# EasyEDA Pro project 智能车核心板.epro

# Schematic 底座核心板

## Sheets
1 底座核心板: Board Name: Board1; Create Date: 2025-10-22; Page Name: 底座核心板; Project Name: 智能车中控核心板; Schematic Name: 底座核心板; Update Date: 2026-01-29; Company: 嘉立创EDA; Page Size: A4; Version: V1.0
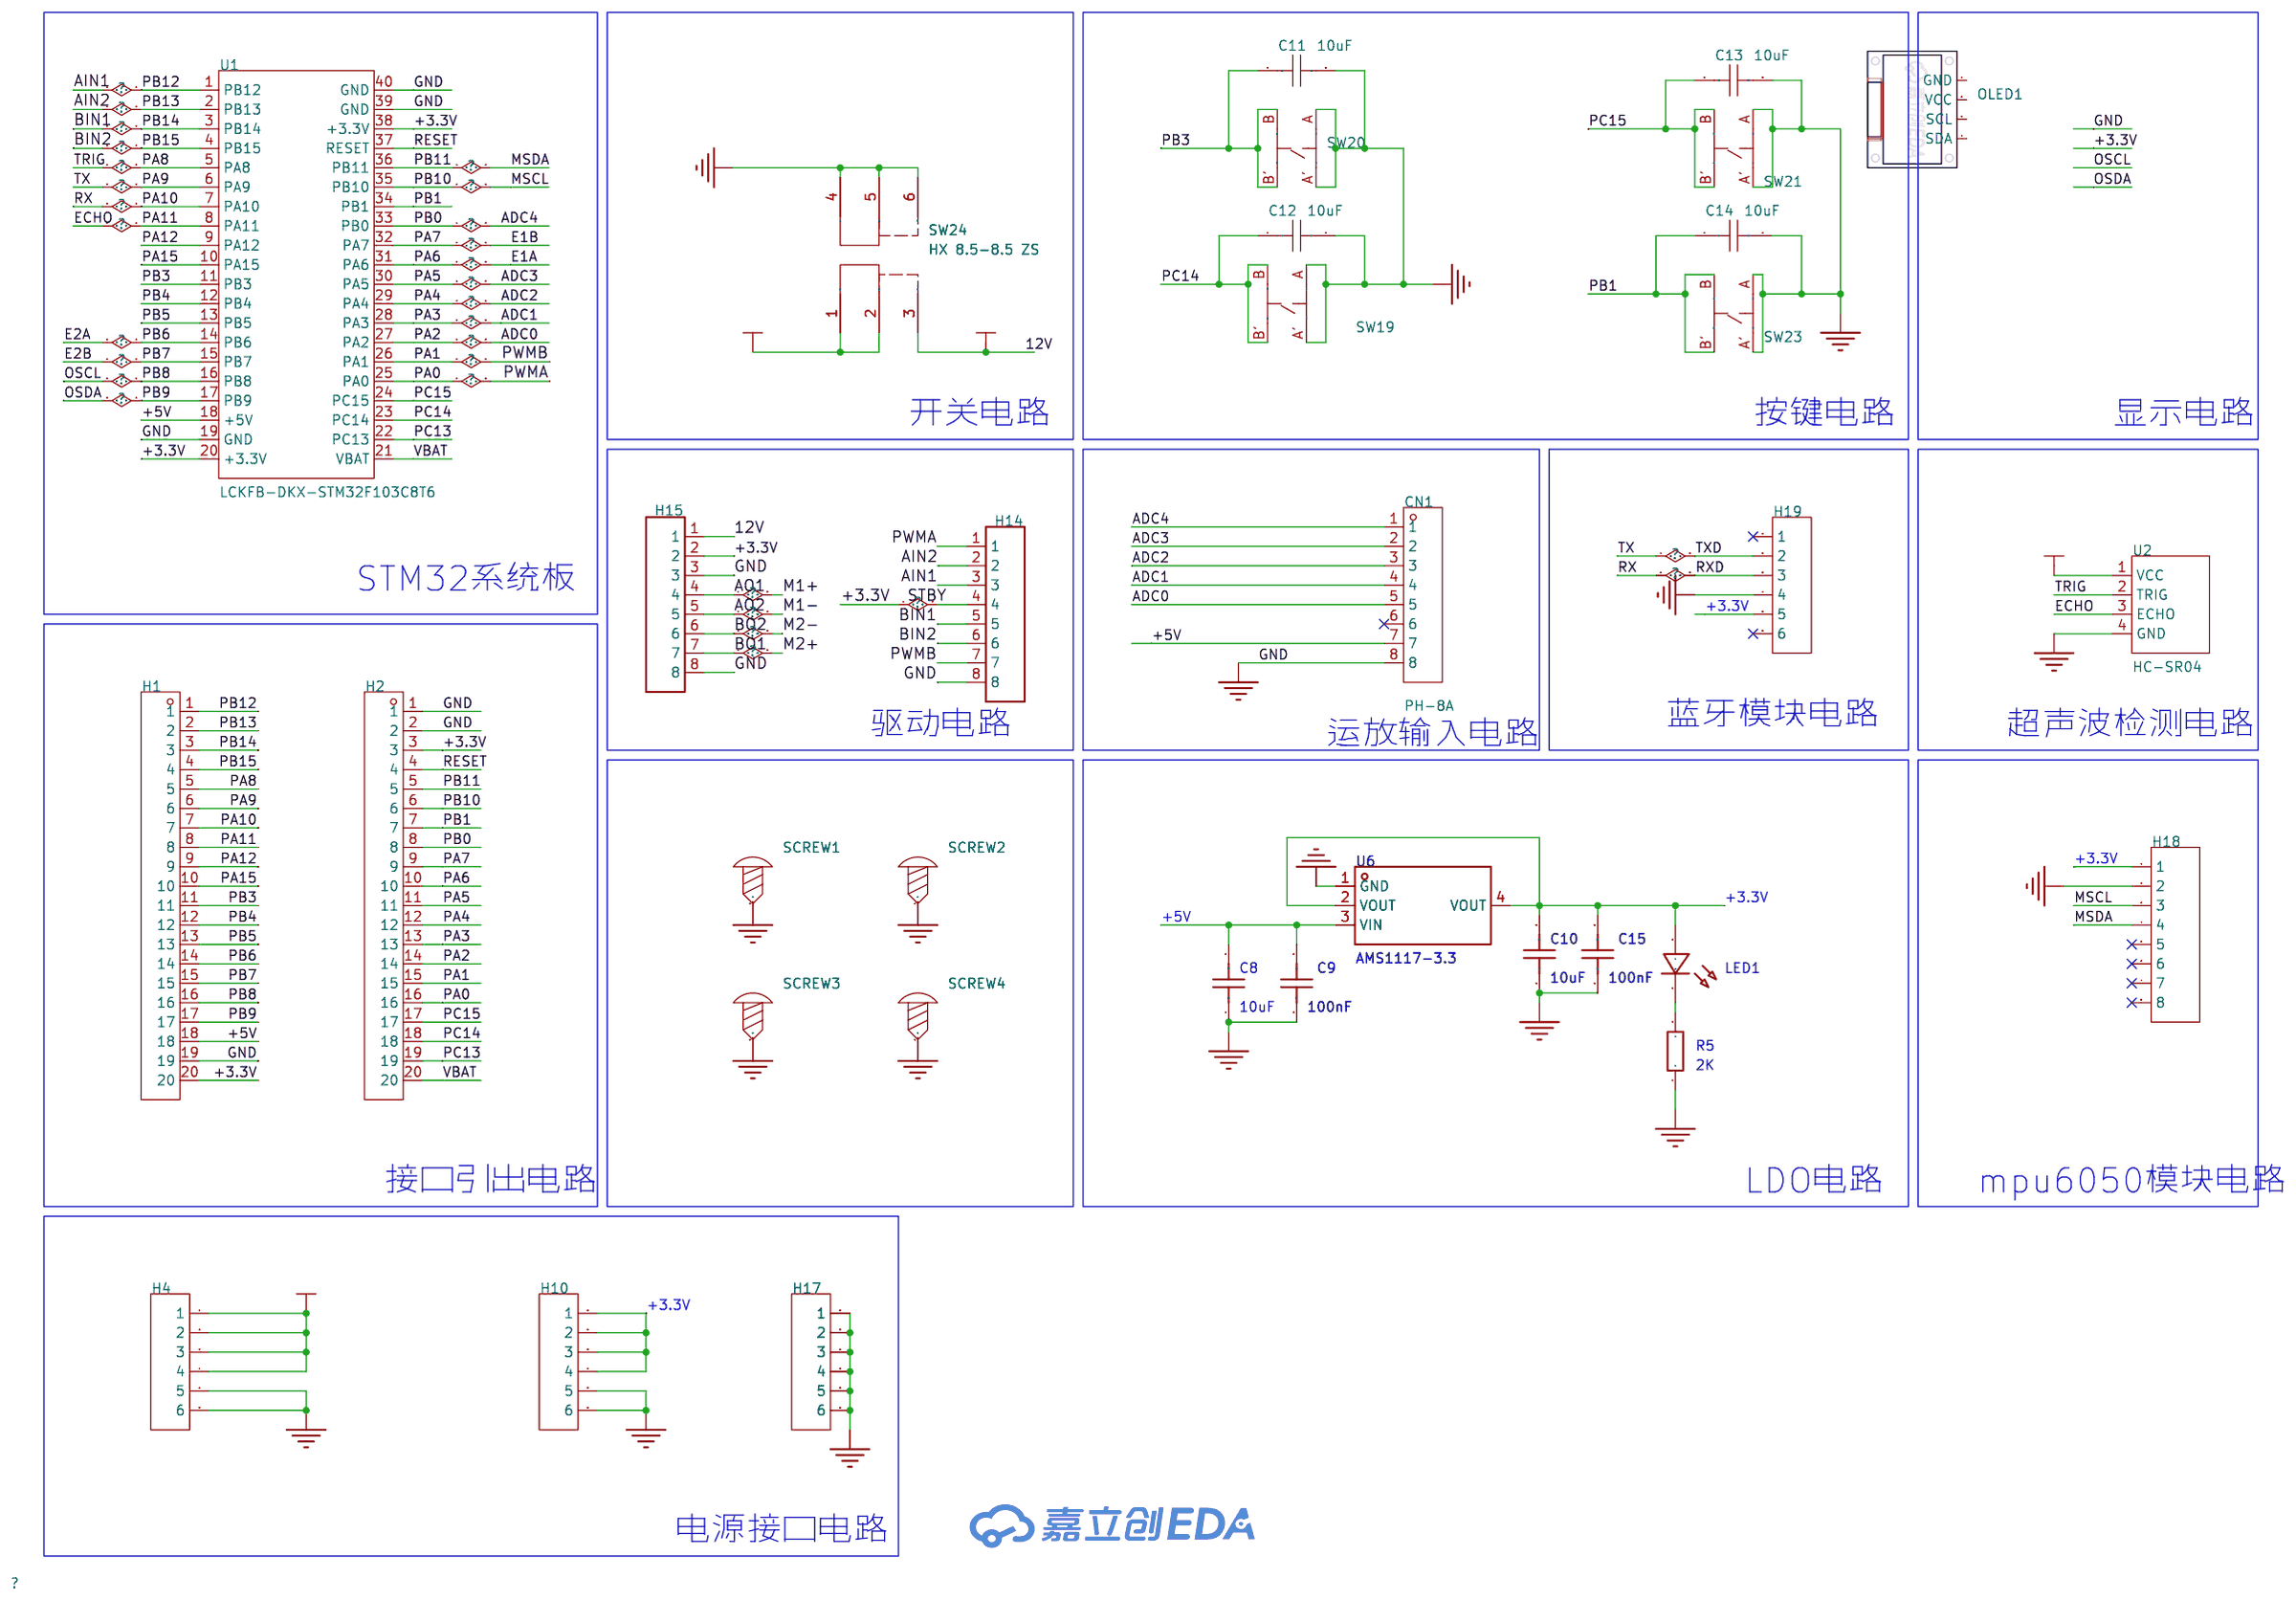
[diagram p0: 底座核心板]
2 P2: Create Date: 2025-12-08; Page Name: P2; Update Date: 2025-12-09
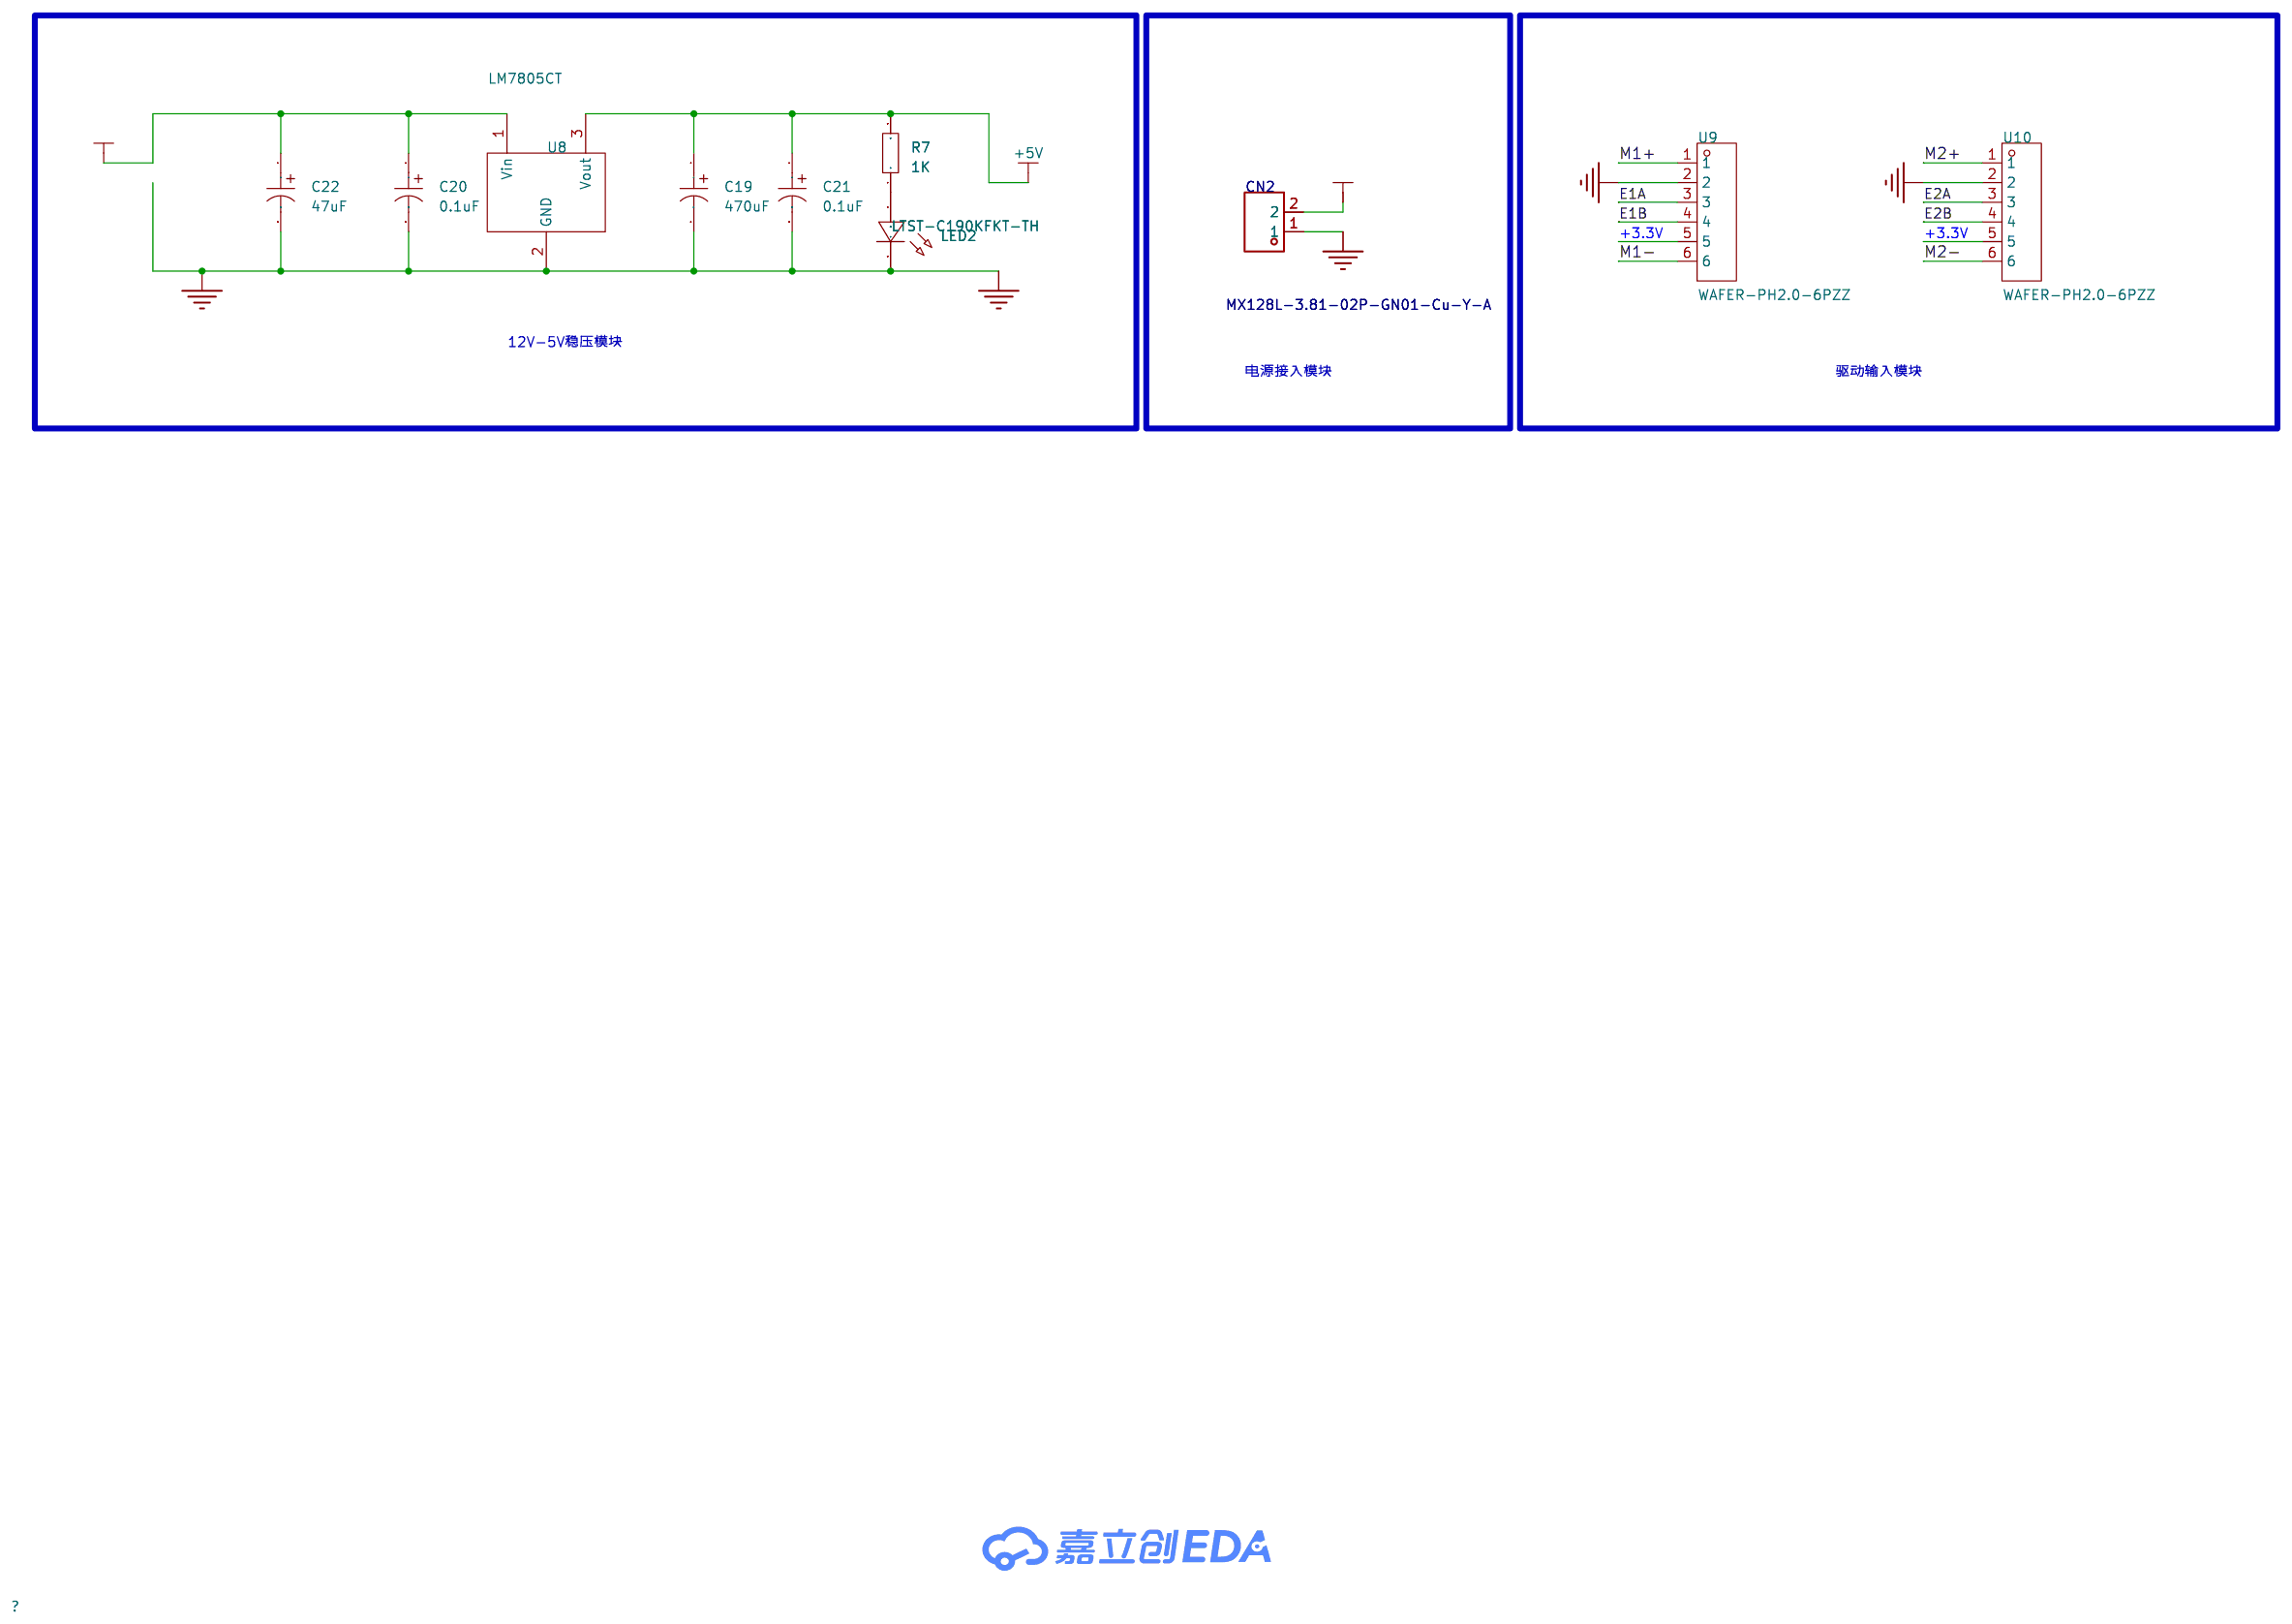
[diagram p1: P2]

## Parts
sheet P2
C19  470uF  [CAP-TH_BD6.3-P2.50-D1.0-FD]
C20  0.1uF  [CAP-TH_BD6.3-P2.50-D1.0-FD]
C21  0.1uF  [CAP-TH_BD6.3-P2.50-D1.0-FD]
C22  47uF  [CAP-TH_BD6.3-P2.50-D1.0-FD]
CN2  MX128L-3.81-02P-GN01-Cu-Y-A  [CONN-TH_2P-P3.81_MX128L-3.81-GN01-02P-CU-Y-A]
LED2  LTST-C190KFKT-TH  [LED0603-RD]
R7  1K  [R0603]
U8  LM7805CT  [TO-220F-3_L10.2-W4.9-P2.54-L]
U9  WAFER-PH2.0-6PZZ  [CONN-TH_6P-P2.00_PH2.0-6P]
U10  WAFER-PH2.0-6PZZ  [CONN-TH_6P-P2.00_PH2.0-6P]
sheet 底座核心板
C8  10uF  [C0603]
C9  100nF  [C0603]
C10  10uF  [C0603]
C11  10uF  [C0805]
C12  10uF  [C0805]
C13  10uF  [C0805]
C14  10uF  [C0805]
C15  100nF  [C0603]
CN1  PH-8A  [CONN-TH_8P-P2.00_HCTL_PH-8A_C2908629]
H1  -  [HDR-TH_20P-P2.54-V-M-1]
H2  -  [HDR-TH_20P-P2.54-V-M-1]
H4  -  [HDR-TH_6P-P2.54-V-M-1]
H10  -  [HDR-TH_6P-P2.54-V-M-1]
H14  KH-2.54PH180-1X8P-L11.5  [HDR-TH_8P-P2.54-V-M]
H15  KH-2.54PH180-1X8P-L11.5  [HDR-TH_8P-P2.54-V-M]
H17  -  [HDR-TH_6P-P2.54-V-M-1]
H18  -  [HDR-TH_8P-P2.54-V-M]
H19  -  [HDR-TH_6P-P2.54-V-M-1]
LED1  -  [LED_0603]
OLED1  -  [0.96OLED_4P]
R5  2K  [R0603]
SCREW1  -  [M3螺丝]
SCREW2  -  [M3螺丝]
SCREW3  -  [M3螺丝]
SCREW4  -  [M3螺丝]
SW19  SH-6X6X8H-CJ  [SW-TH_4P-L6.0-W6.0-P4.50-LS6.5_EVQPAE07K]
SW20  SH-6X6X8H-CJ  [SW-TH_4P-L6.0-W6.0-P4.50-LS6.5_EVQPAE07K]
SW21  SH-6X6X8H-CJ  [SW-TH_4P-L6.0-W6.0-P4.50-LS6.5_EVQPAE07K]
SW23  SH-6X6X8H-CJ  [SW-TH_4P-L6.0-W6.0-P4.50-LS6.5_EVQPAE07K]
SW24  HX 8.5-8.5 ZS  [SW-TH_6P-L8.5-W8.5-P2.50_8.5-8.5-ZS]
U1  LCKFB-DKX-STM32F103C8T6  [CONN-TH_L53.3-W22.9_STM32F103C8T6-CARD]
U2  HC-SR04  [TH_HC-SR04V]
U6  AMS1117-3.3  [SOT-223-3_L6.5-W3.4-P2.30-LS7.0-BR]

## Library data of the parts
C19-C22 = RVT47UF35V67RV0039: 容值:47uF;精度:±20%;额定电压:35V;纹波电流:16.4mA@120Hz;等效串联电阻:-;; LCSC Part Name: 47uF ±20% 35V; Supplier Part: C2836440; Manufacturer: KNSCHA(科尼盛); Supplier Footprint: SMD,D6.3xL5.4mm; JLCPCB Part Class: 扩展库; Datasheet: https://atta.szlcsc.com/upload/public/pdf/source/20210528/C2836440_FB61BB3A7A46B9CC2A608A35871DBF0C.pdf; Supplier: LCSC; Tolerance: ±20%; Rated Voltage: 35V; Ripple Current: 16.4mA@120Hz; φD: 6.3mm; L: 5.4mm; Lifetime @ Temp: 2000hrs@105℃; Operating Temperature: -55℃~+105℃
CN2 = MX128L-3.81-02P-GN01-Cu-Y-A: LCSC Part Name: 1x2P 3.81mm 直插 排数:1 每排P数:2; Supplier Part: C5188452; Manufacturer: MAX(迈旭); Supplier Footprint: 插件,P=3.81mm; JLCPCB Part Class: 扩展库; Datasheet: https://atta.szlcsc.com/upload/public/pdf/source/20230914/B6D11694B2EF123065C24316748628EB.pdf; Supplier: LCSC; Structure: 1x2P; Pitch: 3.81mm; Color: 绿色; Mounting Style: 直插; Number of Pins: 2P; Number of Rows: 1; Number of PINs Per Row: 2; Screw Specification: M2; Current Rating (Max): 10A; Voltage Rating (Max): 150V; Wire Gauge - AWG: 16~26; Wire Gauge - mm2: 1.5; Operating Temperature Range: -40℃~+105℃
LED2 = LTST-C190KFKT-TH: Supplier Part: C284899; Manufacturer: LITEON(光宝); Supplier Footprint: 0603; JLCPCB Part Class: Extended Part; Supplier: LCSC
R5 R7 = Res_0603: Supplier Footprint: 0603
U8 = LM7805L-TF3-T: 输出类型:固定;最大输入电压:35V;输出电压:5V;最大输出电流:1A;输出极性:正极;; LCSC Part Name: 输入35V 输出5V 1A; Supplier Part: C71107; Manufacturer: UTC(友顺); Supplier Footprint: TO-220F-3; JLCPCB Part Class: 扩展库; Datasheet: https://atta.szlcsc.com/upload/public/pdf/source/20181206/C340686_D2C52CCE1AC045CB34E577EA6F7FDCA6.pdf; Supplier: LCSC; Output Type: 固定; Maximum Input Voltage: 35V; Output Voltage: 5V; MAX Output Current: 1A; Dropout Voltage: 2V; Output Polarity: 正极; Number of Outputs: 1
U9 U10 = WAFER-PH2.0-6PZZ: 插针结构:1x6P;间距:2mm;安装方式:直插;参考系列:PH;总PIN数:6P;排数:1;每排PIN数:6;行距:-;额定电流:2A;触头材质:黄铜;触头镀层:锡;工作温度:-25℃~+85℃;; LCSC Part Name: 1x6P 间距:2mm 直插 系列:PH; Supplier Part: C5359603; Manufacturer: XUNPU(讯普); Supplier Footprint: 插件,P=2mm; JLCPCB Part Class: 扩展库; Datasheet: https://atta.szlcsc.com/upload/public/pdf/source/20241108/09B74E94153224768C62B7F095CB8C18.pdf; Supplier: LCSC; Pins Structure: 1x6P; Pitch: 2mm; Mounting Type: 直插; Reference Series: PH; Number of Pins: 6P; Number of Rows: 1; Number of PINs Per Row: 6; Current Rating: 2A; Contact Material: 黄铜; Contact Plating: 锡; Operating Temperature: -25℃~+85℃; Voltage Rating: 250V; Plastic Material: PA66; Flame Retardant Rating: UL94V-0; Color: 白色; Z-Height of the Board: 6.05mm; X-Length of Bottom Edge on Board (Spacing Line): 14mm; Y-Width of Bottom Edge on Board: 4.7mm
C8-C10 C15 = CAP_0603: Supplier Footprint: 0603
C11-C14 = CAP_0805: Supplier Footprint: 0805
CN1 = PH-8A_C2908629: 插针结构:1x8P;间距:2mm;安装方式:直插;参考系列:PH;总PIN数:8P;排数:1;每排PIN数:8;行距:-;额定电流:2A;触头材质:黄铜;触头镀层:锡;工作温度:-25℃~+85℃;; LCSC Part Name: 米色 1x8P 间距:2mm 直插 系列:PH; Supplier Part: C2908629; Manufacturer: HCTL(华灿天禄); Supplier Footprint: 插件,P=2mm; JLCPCB Part Class: 扩展库; Datasheet: https://item.szlcsc.com/datasheet/PH-8A/3184400.html; Supplier: LCSC; Pins Structure: 1x8P; Pitch: 2mm; Mounting Type: 直插; Reference Series: PH; Number of Pins: 8P; Number of Rows: 1; Number of PINs Per Row: 8; Current Rating: 2A; Contact Material: 黄铜; Contact Plating: 锡; Operating Temperature: -25℃~+85℃; Voltage Rating: 250V; Plastic Material: PA66; Flame Retardant Rating: UL94V-0
H1 H2 = HDR-M_2.54_1x20P: 间距:2.54mm;总PIN位数:20;排数:1;插针结构:-;行距:-;安装类型:直插;圆针/方针:-;额定电流:-;额定电压:-;配合针长度:-;塑高:-;触头材质:黄铜;触头镀层:-;颜色:黑色;; Supplier Part: C50981; Supplier Footprint: 插件
H4 H10 H17 H19 = HDR-M_2.54_1x6P: Supplier Part: C37208; Supplier Footprint: 插件
H14 H15 = KH-2.54PH180-1X8P-L11.5: Supplier: LCSC; Supplier Part: C2905487; Manufacturer: kinghelm(金航标); JLCPCB Part Class: Extended Part; Contributor: LCSC; spicePre: H
H18 = HDR-M_2.54_1x8P: Supplier Part: C124381; Supplier Footprint: 插件
LED1 = LED_0603-G: Supplier Footprint: 0603
OLED1 = 0.96OLED模块_4P: Supplier Footprint: 插件
SCREW1-SCREW4 = M3螺丝: Supplier Footprint: 插件
SW19-SW21 SW23 = SH-6X6X8H-CJ: 电路结构:单刀单掷;按钮形状:圆形按钮;作用力:2.5N;安装方式:直插;开关长度:6mm;开关宽度:6mm;开关高度:8mm;带支架:不带支架;触点电流:50mA;额定电压:12V;带灯:无;工作寿命:10万次;; LCSC Part Name: 6*6/6x6 轻触开关; Supplier Part: C42416249; Manufacturer: SHOU HAN(首韩); Supplier Footprint: DIP-4P,6x6mm; JLCPCB Part Class: 扩展库; Datasheet: https://item.szlcsc.com/datasheet/SH-6X6X8H-CJ/44415296.html; Supplier: LCSC; Circuit: 单刀单掷; Actuator Style: 圆形按钮; Operating Force: 2.5N; Mounting Type: 直插; Length: 6mm; Width: 6mm; Switch Height: 8mm; with Bracket: 不带支架; Contact Current: 50mA; Voltage Rating: 12V; Actuator/Cap Color: 黑色; With Lamp: 无; Termination Style: PC引脚; Life: 10万次; Operating Temperature: -25℃~+70℃
SW24 = HX 8.5-8.5 ZS: 电路结构:双刀双掷;自锁/无锁:自锁;安装方式:直插;触点电流:100mA;额定电压:30V;带灯:不带;作用力:1.8N;工作寿命:5千次;; LCSC Part Name: 按键开关8.5x8.5 自锁高头 180gf; Supplier Part: C7435561; Manufacturer: hanxia(韩下); Supplier Footprint: DIP; JLCPCB Part Class: Extended Part; Datasheet: https://item.szlcsc.com/datasheet/HX%25208.5-8.5%2520ZS/8451771.html; Supplier: LCSC; Circuit: 双刀双掷; Self Lock / No Lock: 自锁; Actuator Style: 矩形柱塞; Mounting Type: 直插; Contact Current: 100mA; Voltage Rating: 30V; Actuator/Cap Color: 白色; With Lamp: 不带; Termination Style: PC引脚; Operating Force: 1.8N; Operating Temperature: -10℃~+70℃; Life: 5千次
U1 = LCKFB-DKX-STM32F103C8T6: LCSC Part Name: 立创·地阔星-STM32F103C8T6开发板; Supplier Part: C22396880; Manufacturer: 立创开发板; JLCPCB Part Class: 扩展库; Datasheet: https://item.szlcsc.com/datasheet/LCKFB-DKX-STM32F103C8T6/24005615.html; Supplier: LCSC
U2 = HC-SR04: Supplier Part: C19857336; Manufacturer: Universal Microelectronics; JLCPCB Part Class: 扩展库; Datasheet: https://atta.szlcsc.com/upload/public/pdf/source/20240122/47B8E374E428935B7962A2189EF91AAC.pdf; Supplier: LCSC
U6 = AMS1117-3.3_C6186: LCSC Part Name: 输出3.3V 1A; Supplier Part: C6186; Manufacturer: AMS; Supplier Footprint: SOT-223; JLCPCB Part Class: 基础库; Datasheet: https://atta.szlcsc.com/upload/public/pdf/source/20180727/C6186_7A095716F0823C02F1997A905E26C086.pdf; Supplier: LCSC; Output Type: 固定; Output Voltage: 3.3V; MAX Output Current: 1A; Power Supply Rejection Ratio (PSRR): 72dB@(120Hz); Dropout Voltage: 1.3V@(800mA); Output Polarity: 正极; Number of Outputs: 1

## Nets
12V: C20.1 C22.1 H15.1 SW24.3 U8.1(Vin)
+3.3V: C10.2 C15.2 H1.20 H2.3 H10.1 H10.2 H10.3 H10.4 H14.4 H15.2 H18.1 H19.5 LED1.2(A) U1.20(+3.3V) U1.38(+3.3V) U6.2(VOUT) U6.4(VOUT) U9.5 U10.5
+5V: C8.2 C9.2 C19.1 C21.1 CN1.7 H1.18 H4.1 H4.2 H4.3 H4.4 R7.2 U1.18(+5V) U2.1(VCC) U6.3(VIN) U8.3(Vout)
GND: C8.1 C9.1 C10.1 C11.2 C12.2 C13.2 C14.2 C15.1 C19.2 C20.2 C21.2 C22.2 CN1.8 CN2.1 H1.19 H2.1 H2.2 H4.5 H4.6 H10.5 H10.6 H14.8 H15.3 H15.8 H17.1 H17.2 H17.3 H17.4 H17.5 H17.6 H18.2 H19.4 LED2.2(A) R5.1 SCREW1.1 SCREW2.1 SCREW3.1 SCREW4.1 SW19.A SW19.A' SW20.A SW20.A' SW21.A SW21.A' SW23.A SW23.A' SW24.4 SW24.5 SW24.6 U1.19(GND) U1.39(GND) U1.40(GND) U2.4(GND) U6.1(GND) U8.2(GND) U9.2 U10.2
VBAT: H2.20 U1.21(VBAT)
ADC0: CN1.5 H2.14 U1.27(PA2)
ADC1: CN1.4 H2.13 U1.28(PA3)
ADC2: CN1.3 H2.12 U1.29(PA4)
ADC3: CN1.2 H2.11 U1.30(PA5)
ADC4: CN1.1 H2.8 U1.33(PB0)
AIN1: H1.1 H14.3 U1.1(PB12)
AIN2: H1.2 H14.2 U1.2(PB13)
AO1: H15.4 U9.1
AO2: H15.5 U9.6
BIN1: H1.3 H14.5 U1.3(PB14)
BIN2: H1.4 H14.6 U1.4(PB15)
BO1: H15.7 U10.1
BO2: H15.6 U10.6
E1A: H2.10 U1.31(PA6) U9.3
E1B: H2.9 U1.32(PA7) U9.4
E2A: H1.14 U1.14(PB6) U10.3
E2B: H1.15 U1.15(PB7) U10.4
ECHO: H1.8 U1.8(PA11) U2.3(ECHO)
INPUT: CN2.2 SW24.1 SW24.2
MSCL: H2.6 H18.3 U1.35(PB10)
MSDA: H2.5 H18.4 U1.36(PB11)
OSCL: H1.16 U1.16(PB8)
OSDA: H1.17 U1.17(PB9)
PA0: H2.16 H14.1 U1.25(PA0)
PA1: H2.15 H14.7 U1.26(PA1)
PA8: H1.5 U1.5(PA8) U2.2(TRIG)
PA9: H1.6 H19.2 U1.6(PA9)
PA10: H1.7 H19.3 U1.7(PA10)
PA12: H1.9 U1.9(PA12)
PA15: H1.10 U1.10(PA15)
PB1: C14.1 H2.7 SW23.B SW23.B' U1.34(PB1)
PB3: C11.1 H1.11 SW20.B SW20.B' U1.11(PB3)
PB4: H1.12 U1.12(PB4)
PB5: H1.13 U1.13(PB5)
PC13: H2.19 U1.22(PC13)
PC14: C12.1 H2.18 SW19.B SW19.B' U1.23(PC14)
PC15: C13.1 H2.17 SW21.B SW21.B' U1.24(PC15)
RESET: H2.4 U1.37(RESET)
$1N9451: LED1.1(C) R5.2
$2N419: LED2.1(C) R7.1

Not connected (* = marked no-connect by the designer): CN1 6*; H18 5* 6* 7* 8*; H19 1* 6*; OLED1 1(GND) 2(VCC) 3(SCL) 4(SDA)

## Notes on the sheets
sheet 1
- 开关电路
- 按键电路
- 显示电路
- STM32系统板
- 蓝牙模块电路
- 驱动电路
- 运放输入电路
- 超声波检测电路
- 接口引出电路
- LDO电路
- mpu6050模块电路
- 电源接口电路
sheet 2
- 12V-5V稳压模块
- 电源接入模块
- 驱动输入模块

# Board PCB1
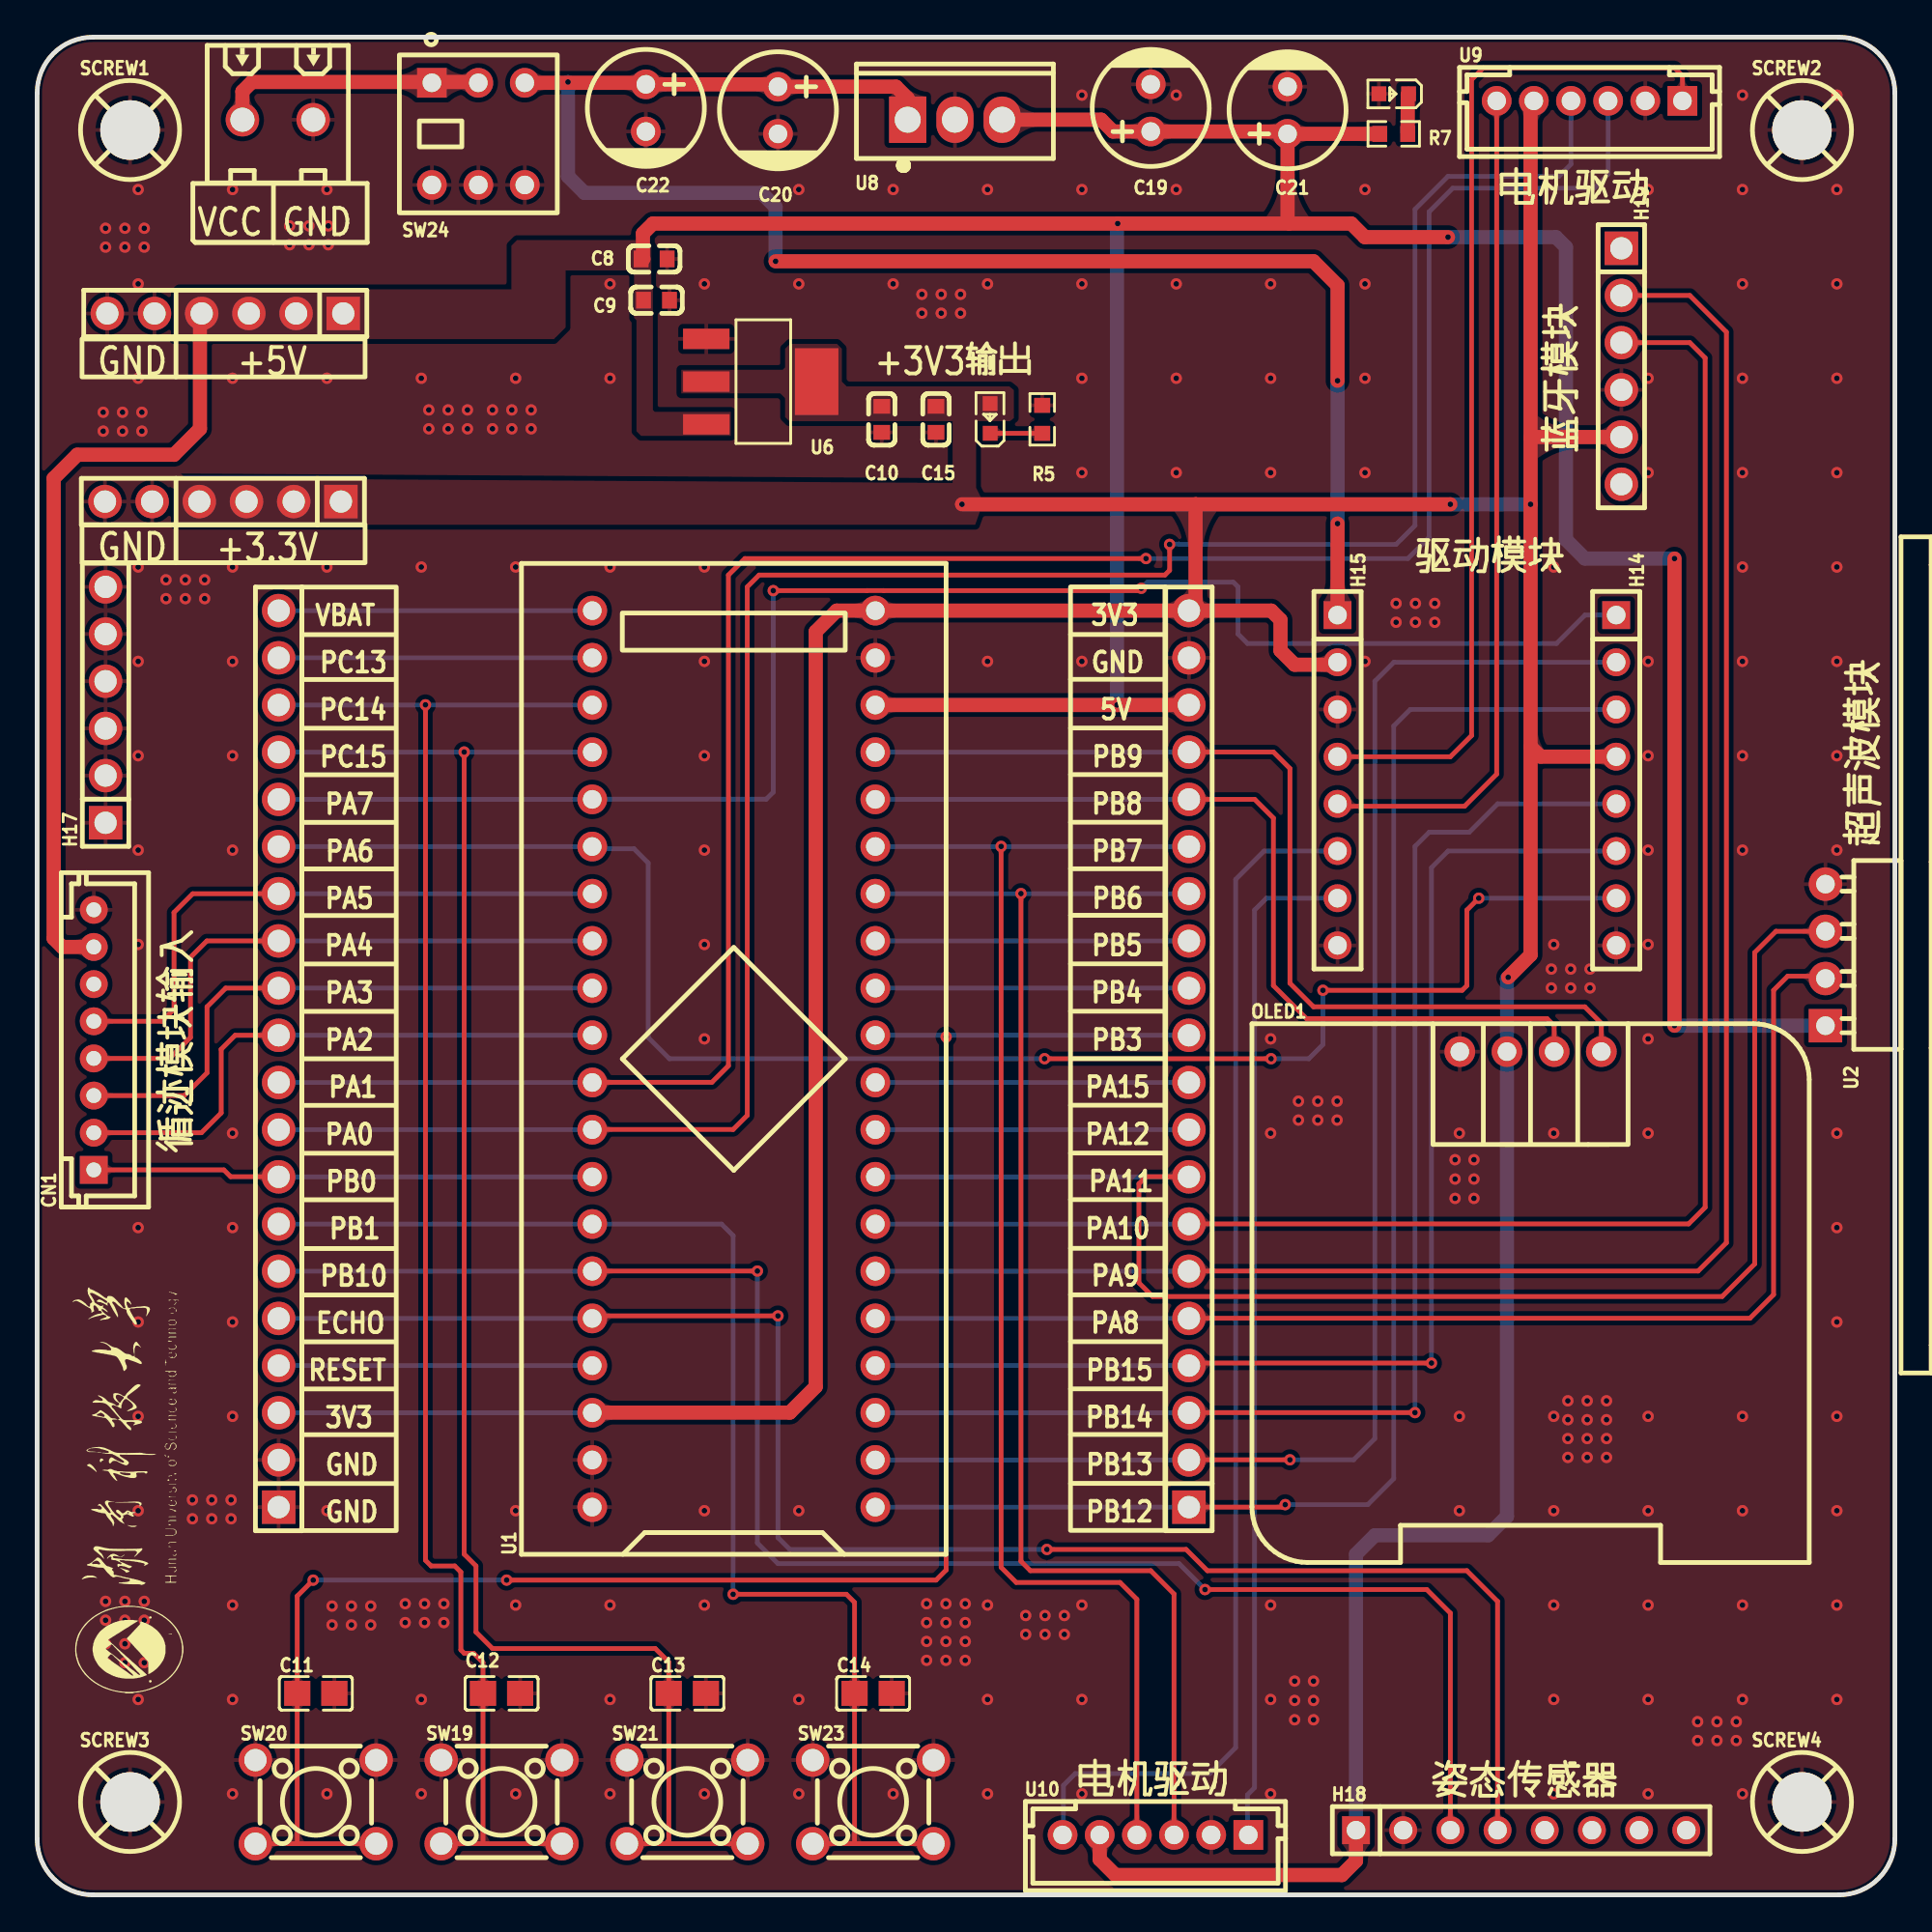
[diagram p2: board, top side]
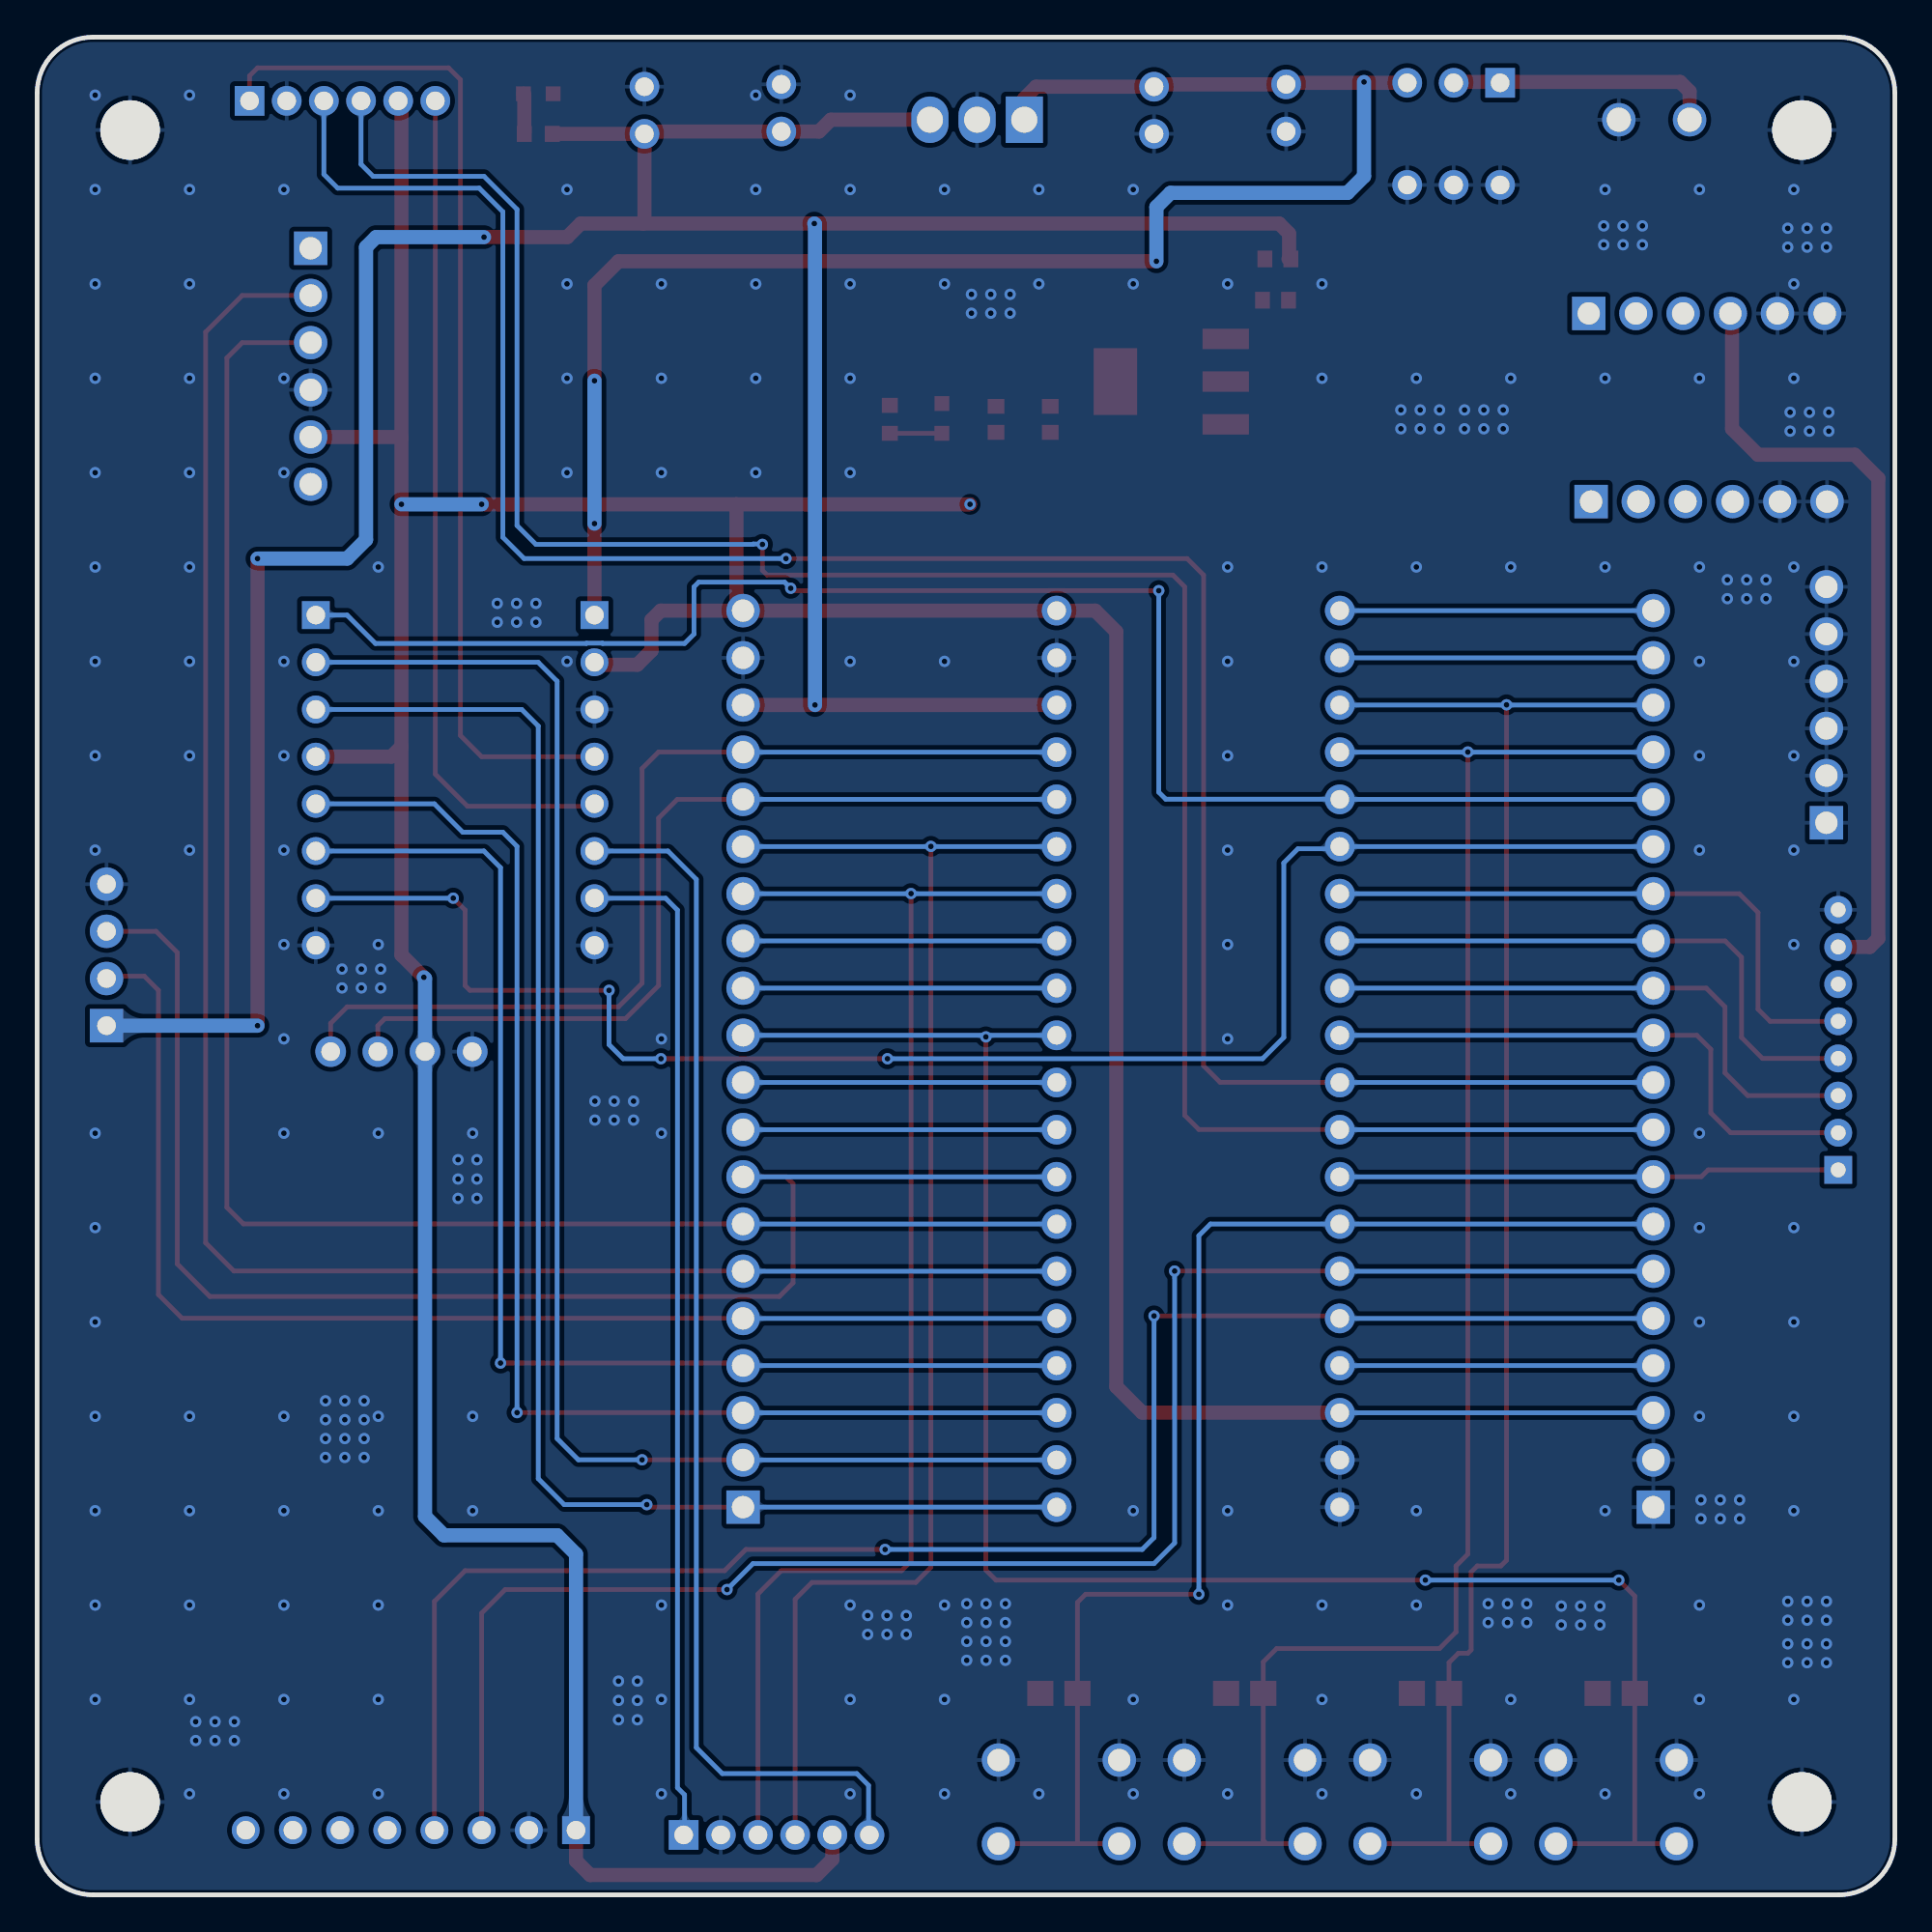
[diagram p3: board, bottom side, seen from below]

Outline 100 x 100 mm; copper layers: Top Layer, Bottom Layer. Coordinates in mm from the lower left corner of the outline.
Outline path: 0,97 0,3 arc(0.88,0.88) 3,0 97,0 arc(99.12,0.88) 100,3 100,97 arc(99.12,99.12) 97,100 3,100 arc(0.88,99.12) 0,97
Stack: Top Layer 0.035mm / Dielectric1 1.51mm FR4 er 4.5 / Bottom Layer 0.035mm

## Design rules (mm)
template: JLCPCB Capability(Two Layers Board)
spacing copperThickness1oz (default): track to track 0.102, other pairs 0.152 to 0.3
spacing copperThickness2oz: track to track 0.203, other pairs 0.152 to 0.3
track width copperThickness1oz (default): min 0.127, default 0.254, max 2.54
track width copperThickness2oz: min 0.203, default 0.254, max 2.54
differential pair differentialPair (default): width min 0.127, default 0.254, max 2.54; gap min 0.152, default 0.152
via viaSize (default): diameter min 0.5, default 0.61, max 10; hole min 0.3, default 0.305, max 6.3

## Placement (name value [footprint] x y rotation side)
C8  10uF  [C0603]  33.21 88.06 180 top
C9  100nF  [C0603]  33.34 85.84 180 top
C10  10uF  [C0603]  45.47 79.43 90 top
C11  10uF  [C0805]  15 10.85 0 top
C12  10uF  [C0805]  25 10.85 0 top
C13  10uF  [C0805]  35 10.85 0 top
C14  10uF  [C0805]  45 10.85 0 top
C15  100nF  [C0603]  48.38 79.43 90 top
C19  470uF  [CAP-TH_BD6.3-P2.50-D1.0-FD]  59.94 96.19 90 top
C20  0.1uF  [CAP-TH_BD6.3-P2.50-D1.0-FD]  39.88 96.06 270 top
C21  0.1uF  [CAP-TH_BD6.3-P2.50-D1.0-FD]  67.31 96.06 90 top
C22  47uF  [CAP-TH_BD6.3-P2.50-D1.0-FD]  32.77 96.19 270 top
CN1  PH-8A  [CONN-TH_8P-P2.00_HCTL_PH-8A_C2908629]  3.05 46.03 90 top
CN2  MX128L-3.81-02P-GN01-Cu-Y-A  [CONN-TH_2P-P3.81_MX128L-3.81-GN01-02P-CU-Y-A]  12.95 95.56 180 top
H1  -  [HDR-TH_20P-P2.54-V-M-1]  62 45 90 top
H2  -  [HDR-TH_20P-P2.54-V-M-1]  13 45 90 top
H4  -  [HDR-TH_6P-P2.54-V-M-1]  10.13 85.13 180 top
H10  -  [HDR-TH_6P-P2.54-V-M-1]  10 75 180 top
H14  KH-2.54PH180-1X8P-L11.5  [HDR-TH_8P-P2.54-V-M]  85 60 270 top
H15  KH-2.54PH180-1X8P-L11.5  [HDR-TH_8P-P2.54-V-M]  70 60 270 top
H17  -  [HDR-TH_6P-P2.54-V-M-1]  3.68 64.06 90 top
H18  -  [HDR-TH_8P-P2.54-V-M]  79.88 3.48 0 top
H19  -  [HDR-TH_6P-P2.54-V-M-1]  85.28 82.28 270 top
LED1  -  [LED_0603]  51.29 79.53 90 top
LED2  LTST-C190KFKT-TH  [LED0603-RD]  73.03 96.95 180 top
OLED1  -  [0.96OLED_4P]  80.39 45.39 0 top
R5  2K  [R0603]  54.1 79.43 270 top
R7  1K  [R0603]  73.03 94.79 180 top
SCREW1  -  [M3螺丝]  5 95 0 top
SCREW2  -  [M3螺丝]  95 95 0 top
SCREW3  -  [M3螺丝]  5 5 0 top
SCREW4  -  [M3螺丝]  95 5 0 top
SW19  SH-6X6X8H-CJ  [SW-TH_4P-L6.0-W6.0-P4.50-LS6.5_EVQPAE07K]  25 5 0 top
SW20  SH-6X6X8H-CJ  [SW-TH_4P-L6.0-W6.0-P4.50-LS6.5_EVQPAE07K]  15 5 0 top
SW21  SH-6X6X8H-CJ  [SW-TH_4P-L6.0-W6.0-P4.50-LS6.5_EVQPAE07K]  35 5 0 top
SW23  SH-6X6X8H-CJ  [SW-TH_4P-L6.0-W6.0-P4.50-LS6.5_EVQPAE07K]  45 5 0 top
SW24  HX 8.5-8.5 ZS  [SW-TH_6P-L8.5-W8.5-P2.50_8.5-8.5-ZS]  23.75 94.79 180 top
U1  LCKFB-DKX-STM32F103C8T6  [CONN-TH_L53.3-W22.9_STM32F103C8T6-CARD]  37.5 45 90 top
U2  HC-SR04  [TH_HC-SR04V]  96.27 50.6 90 top
U6  AMS1117-3.3  [SOT-223-3_L6.5-W3.4-P2.30-LS7.0-BR]  38.99 81.46 180 top
U8  LM7805CT  [TO-220F-3_L10.2-W4.9-P2.54-L]  49.4 95.56 0 top
U9  WAFER-PH2.0-6PZZ  [CONN-TH_6P-P2.00_PH2.0-6P]  83.57 96.57 0 top
U10  WAFER-PH2.0-6PZZ  [CONN-TH_6P-P2.00_PH2.0-6P]  60.2 3.23 0 top

## Footprints (pads in the part's own frame, mm; a bottom-side part is the same pattern mirrored in y, then rotated)
0.96OLED_4P
  round 1.65 hole 1: 1(-3.81,-0.002) 2(-1.27,0.002) 3(1.27,0.002) 4(3.81,0.002)
C0603
  rect 0.8x0.9 smd: 1(-0.7,0) 2(0.7,0)
C0805
  rect 1.41x1.35 smd: 1(-1,0) 2(1,0)
CAP-TH_BD6.3-P2.50-D1.0-FD
  round 1.6 hole 1: 1(-1.27,0) 2(1.27,0)
CONN-TH_2P-P3.81_MX128L-3.81-GN01-02P-CU-Y-A
  round 1.8 hole 1.3: 1(-1.905,0) 2(1.905,0)
CONN-TH_6P-P2.00_PH2.0-6P
  rect 1.6x1.6 hole 1: 1(5,0)
  round 1.6 hole 1: 2(3,0) 3(1,0) 4(-1,0) 5(-3,0) 6(-5,0)
CONN-TH_8P-P2.00_HCTL_PH-8A_C2908629
  rect 1.5x1.5 hole 0.8: 1(-7,0)
  round 1.5 hole 0.8: 2(-5,0) 3(-3,0) 4(-1,0) 5(1,0) 6(3,0) 7(5,0) 8(7,0)
CONN-TH_L53.3-W22.9_STM32F103C8T6-CARD
  round 1.6 hole 1: 1(-24.13,-7.62) 2(-21.59,-7.62) 3(-19.05,-7.62) 4(-16.51,-7.62) 5(-13.97,-7.62) 6(-11.43,-7.62) 7(-8.89,-7.62) 8(-6.35,-7.62) 9(-3.81,-7.62) 10(-1.27,-7.62) 11(1.27,-7.62) 12(3.81,-7.62) 13(6.35,-7.62) 14(8.89,-7.62) 15(11.43,-7.62) 16(13.97,-7.62) 17(16.51,-7.62) 18(19.05,-7.62) 19(21.59,-7.62) 20(24.13,-7.62) 21(24.13,7.62) 22(21.59,7.62) 23(19.05,7.62) 24(16.51,7.62) 25(13.97,7.62) 26(11.43,7.62) 27(8.89,7.62) 28(6.35,7.62) 29(3.81,7.62) 30(1.27,7.62) 31(-1.27,7.62) 32(-3.81,7.62) 33(-6.35,7.62) 34(-8.89,7.62) 35(-11.43,7.62) 36(-13.97,7.62) 37(-16.51,7.62) 38(-19.05,7.62) 39(-21.59,7.62) 40(-24.13,7.62)
HDR-TH_6P-P2.54-V-M-1
  rect 1.8x1.8 hole 1.2: 1(-6.35,0)
  round 1.8 hole 1.2: 2(-3.81,0) 3(-1.27,0) 4(1.27,0) 5(3.81,0) 6(6.35,0)
HDR-TH_8P-P2.54-V-M
  rect 1.5x1.5 hole 1: 1(-8.89,0)
  round 1.5 hole 1: 2(-6.35,0) 3(-3.81,0) 4(-1.27,0) 5(1.27,0) 6(3.81,0) 7(6.35,0) 8(8.89,0)
HDR-TH_20P-P2.54-V-M-1
  rect 1.8x1.8 hole 1.2: 1(-24.13,0)
  round 1.8 hole 1.2: 2(-21.59,0) 3(-19.05,0) 4(-16.51,0) 5(-13.97,0) 6(-11.43,0) 7(-8.89,0) 8(-6.35,0) 9(-3.81,0) 10(-1.27,0) 11(1.27,0) 12(3.81,0) 13(6.35,0) 14(8.89,0) 15(11.43,0) 16(13.97,0) 17(16.51,0) 18(19.05,0) 19(21.59,0) 20(24.13,0)
LED0603-RD
  rect 0.8x0.8 smd: 1(-0.799,0) 2(0.799,0)
LED_0603
  rect 0.8x0.8 smd: 1(-0.851,-0.01) 2(0.75,-0.005)
M3螺丝
  round 3.2 hole 3.2: 1(0,0)
R0603
  rect 0.806x0.864 smd: 1(-0.753,0) 2(0.753,0)
SOT-223-3_L6.5-W3.4-P2.30-LS7.0-BR
  rect 2.5x1.1 smd: 1(2.97,-2.3) 2(2.97,0) 3(2.97,2.3)
  rect 2.34x3.6 smd: 4(-2.97,0)
SW-TH_4P-L6.0-W6.0-P4.50-LS6.5_EVQPAE07K
  round 1.8 hole 1.2: A(-3.25,2.25) A'(3.25,2.25) B(-3.25,-2.25) B'(3.25,-2.25)
SW-TH_6P-L8.5-W8.5-P2.50_8.5-8.5-ZS
  rect 1.6x1.6 hole 1: 1(2.5,-2.75)
  round 1.6 hole 1: 2(0,-2.75) 3(-2.5,-2.75) 4(2.5,2.75) 5(0,2.75) 6(-2.5,2.75)
TH_HC-SR04V
  rect 1.8x1.8 hole 1.001: 1(-3.81,0)
  round 1.8 hole 1.001: 2(-1.27,0) 3(1.27,0) 4(3.81,0)
TO-220F-3_L10.2-W4.9-P2.54-L
  rect 2x2.5 hole 1.4: 1(-2.54,0)
  oval 2x2.5 hole 1.4: 2(0,0) 3(2.54,0)

## Nets
As in the schematic, except:
+3.3V: C10.2 C15.2 H1.20 H2.3 H10.1 H10.2 H10.3 H10.4 H14.4 H15.2 H18.1 H19.5 LED1.2 OLED1.2 U1.20 U1.38 U6.2 U6.4 U9.5 U10.5
GND: C8.1 C9.1 C10.1 C11.2 C12.2 C13.2 C14.2 C15.1 C19.2 C20.2 C21.2 C22.2 CN1.8 CN2.1 H1.19 H2.1 H2.2 H4.5 H4.6 H10.5 H10.6 H14.8 H15.3 H15.8 H17.1 H17.2 H17.3 H17.4 H17.5 H17.6 H18.2 H19.4 LED2.2 OLED1.1 R5.1 SCREW1.1 SCREW2.1 SCREW3.1 SCREW4.1 SW19.A SW19.A' SW20.A SW20.A' SW21.A SW21.A' SW23.A SW23.A' SW24.4 SW24.5 SW24.6 U1.19 U1.39 U1.40 U2.4 U6.1 U8.2 U9.2 U10.2
OSCL: H1.16 OLED1.3 U1.16
OSDA: H1.17 OLED1.4 U1.17

Pads without a net: CN1 6; H18 5 6 7 8; H19 1 6

## Via types
v1: diameter 0.61, hole 0.305, Top Layer to Bottom Layer, 327 vias

## Routing (per net, layer and track width the routed paths; a pad name or vN(x,y) marks a point on that pad's centre or on a via; arc(x,y) is an arc through that point)
12V: length 90.5
  Top Layer w0.762: v1(70,81.51) 70,86.64 68.71,87.94 v1(39.75,87.94) ; SW24.3 32.68,97.54 C22.1 39.75,97.46 39.88,97.33 46.23,97.33 46.86,96.7 U8.1 ; H15.1 v1(70,73.81)
  Bottom Layer w0.762: v1(39.75,87.94) 39.75,90.86 38.99,91.62 29.46,91.62 28.57,92.51 v1(28.57,97.59) ; v1(70,81.51) v1(70,73.81)
+3.3V: length 265.2
  Top Layer w0.762: U9.5 80.39,96.4 80.39,78.43 ; H1.20 U1.20 43.04,69.13 41.91,68 41.91,27.36 40.51,25.96 29.89,25.96 U1.38 ; H1.20 62.36,69.49 62.36,74.85 ; H1.20 66.43,69.13 66.93,68.63 66.93,66.98 67.69,66.22 69.87,66.22 H15.2 ; 80.39,61.81 v1(80.39,74.85) 80.39,78.43 ; 80.39,61.81 80.39,50.6 v1(79.18,49.39) ; 80.39,61.81 80.93,61.27 H14.4 ; 62.36,74.85 v1(76.07,74.85) ; 62.36,74.85 v1(49.78,74.85) ; U10.5 57.2,1.91 58.04,1.07 70.23,1.07 70.99,1.83 H18.1 ; H19.5 80.43,78.47 80.39,78.43
  Bottom Layer w0.254: H2.3 U1.38
  Bottom Layer w0.762: v1(76.07,74.85) v1(80.39,74.85) ; v1(79.18,49.39) 79.12,49.33 OLED1.2 79.12,20.37 78.1,19.35 72.01,19.35 70.99,18.34 H18.1
+5V: length 217.8
  Top Layer w0.762: CN1.7 1.35,51.03 0.89,51.49 0.89,76.25 2.16,77.52 7.37,77.52 8.76,78.92 8.76,85.03 H4.4 ; C21.1 67.18,94.92 C19.1 57.91,94.92 57.28,95.56 51.94,95.56 ; C21.1 R7.2 ; C21.1 67.31,90.04 67.39,89.97 ; 67.39,89.97 70.74,89.97 71.47,89.24 v1(75.95,89.24) ; 67.39,89.97 v1(58.17,89.97) 33.15,89.97 32.61,89.43 32.61,88.09 32.64,88.06 ; v1(88.14,46.79) v1(88.14,71.93) ; H1.18 v1(58.13,64.05) U1.18
  Bottom Layer w0.762: v1(58.13,64.05) 58.13,89.93 v1(58.17,89.97) ; v1(75.95,89.24) 81.76,89.24 82.3,88.7 82.3,72.95 83.31,71.93 v1(88.14,71.93) ; 96.27,46.79 v1(88.14,46.79)
GND:
  vias: v1(3.56,79.81) v1(3.56,78.79) v1(3.68,89.71) v1(3.68,88.7) v1(3.68,15.8) v1(3.68,14.78) v1(3.68,13.51) v1(3.68,12.5) v1(4.6,79.81) v1(4.6,78.79) v1(4.72,89.71) v1(4.72,88.7) v1(4.72,15.8) v1(4.72,14.78) v1(4.72,13.51) v1(4.72,12.5) v1(5.44,91.8) v1(5.44,86.72) v1(5.44,81.64) v1(5.44,71.48) v1(5.44,66.4) v1(5.44,61.32) v1(5.44,56.24) v1(5.44,51.16) v1(5.44,35.92) v1(5.44,30.84) v1(5.44,25.76) v1(5.44,20.68) v1(5.44,10.52) v1(5.64,79.81) v1(5.64,78.79) v1(5.77,89.71) v1(5.77,88.7) v1(5.77,15.8) v1(5.77,14.78) v1(5.77,13.51) v1(5.77,12.5) v1(6.94,70.79) v1(6.94,69.77) v1(7.98,70.79) v1(7.98,69.77) v1(8.36,21.26) v1(8.36,20.24) v1(9.02,70.79) v1(9.02,69.77) v1(9.4,21.26) v1(9.4,20.24) v1(10.44,21.26) v1(10.44,20.24) v1(10.52,91.8) v1(10.52,81.64) v1(10.52,71.48) v1(10.52,66.4) v1(10.52,61.32) v1(10.52,56.24) v1(10.52,41) v1(10.52,35.92) v1(10.52,30.84) v1(10.52,25.76) v1(10.52,15.6) v1(10.52,10.52) v1(10.52,5.44) v1(13.59,89.84) v1(13.59,88.82) v1(14.63,89.84) v1(14.63,88.82) v1(15.6,91.8) v1(15.6,81.64) v1(15.6,71.48) v1(15.6,20.68) v1(15.6,5.44) v1(15.67,89.84) v1(15.67,88.82) v1(15.88,15.54) v1(15.88,14.53) v1(16.92,15.54) v1(16.92,14.53) v1(17.96,15.54) v1(17.96,14.53) v1(19.81,15.67) v1(19.81,14.66) v1(20.68,81.64) v1(20.68,71.48) v1(20.68,10.52) v1(20.68,5.44) v1(20.85,15.67) v1(20.85,14.66) v1(21.08,79.93) v1(21.08,78.92) v1(21.89,15.67) v1(21.89,14.66) v1(22.12,79.93) v1(22.12,78.92) v1(23.16,79.93) v1(23.16,78.92) v1(24.51,79.93) v1(24.51,78.92) v1(25.55,79.93) v1(25.55,78.92) v1(25.76,81.64) v1(25.76,71.48) v1(25.76,20.68) v1(25.76,15.6) v1(25.76,5.44) v1(26.59,79.93) v1(26.59,78.92) v1(30.84,86.72) v1(30.84,81.64) v1(30.84,71.48) v1(30.84,15.6) v1(30.84,10.52) v1(30.84,5.44) v1(35.92,86.72) v1(35.92,71.48) v1(35.92,66.4) v1(35.92,61.32) v1(35.92,56.24) v1(35.92,51.16) v1(35.92,46.08) v1(35.92,20.68) v1(35.92,15.6) v1(35.92,5.44) v1(41,91.8) v1(41,86.72) v1(41,20.68) v1(41,10.52) v1(41,5.44) v1(46.08,91.8) v1(46.08,86.72) v1(46.08,5.44) v1(47.62,86.16) v1(47.62,85.14) v1(47.88,15.67) v1(47.88,14.66) v1(47.88,13.64) v1(47.88,12.62) v1(48.67,86.16) v1(48.67,85.14) v1(48.92,15.67) v1(48.92,14.66) v1(48.92,13.64) v1(48.92,12.62) v1(49.71,86.16) v1(49.71,85.14) v1(49.96,15.67) v1(49.96,14.66) v1(49.96,13.64) v1(49.96,12.62) v1(51.16,91.8) v1(51.16,86.72) v1(51.16,66.4) v1(51.16,15.6) v1(51.16,10.52) v1(51.16,5.44) v1(53.21,15.04) v1(53.21,14.02) v1(54.25,15.04) v1(54.25,14.02) v1(55.29,15.04) v1(55.29,14.02) v1(56.24,96.88) v1(56.24,91.8) v1(56.24,86.72) v1(56.24,81.64) v1(56.24,76.56) v1(56.24,66.4) v1(56.24,15.6) v1(56.24,10.52) v1(56.24,5.44) v1(61.32,96.88) v1(61.32,91.8) v1(61.32,86.72) v1(61.32,81.64) v1(61.32,76.56) v1(66.4,86.72) v1(66.4,81.64) v1(66.4,76.56) v1(66.4,46.08) v1(66.4,41) v1(66.4,15.6) v1(66.4,10.52) v1(66.4,5.44) v1(67.69,11.51) v1(67.69,10.47) v1(67.69,9.42) v1(67.9,42.72) v1(67.9,41.71) v1(68.71,11.51) v1(68.71,10.47) v1(68.71,9.42) v1(68.94,42.72) v1(68.94,41.71) v1(69.98,42.72) v1(69.98,41.71) v1(71.48,91.8) v1(71.48,86.72) v1(71.48,81.64) v1(71.48,76.56) v1(71.48,66.4) v1(73.15,69.52) v1(73.15,68.5) v1(74.19,69.52) v1(74.19,68.5) v1(75.23,69.52) v1(75.23,68.5) v1(76.33,39.57) v1(76.33,38.53) v1(76.33,37.49) v1(76.56,41) v1(76.56,25.76) v1(76.56,20.68) v1(77.34,39.57) v1(77.34,38.53) v1(77.34,37.49) v1(81.51,49.83) v1(81.51,48.82) v1(81.64,71.48) v1(81.64,51.16) v1(81.64,41) v1(81.64,25.76) v1(81.64,20.68) v1(81.64,15.6) v1(81.64,10.52) v1(81.64,5.44) v1(82.4,26.59) v1(82.4,25.58) v1(82.4,24.56) v1(82.4,23.55) v1(82.55,49.83) v1(82.55,48.82) v1(83.44,26.59) v1(83.44,25.58) v1(83.44,24.56) v1(83.44,23.55) v1(83.59,49.83) v1(83.59,48.82) v1(84.48,26.59) v1(84.48,25.58) v1(84.48,24.56) v1(84.48,23.55) v1(86.72,91.8) v1(86.72,81.64) v1(86.72,76.56) v1(86.72,66.4) v1(86.72,61.32) v1(86.72,56.24) v1(86.72,51.16) v1(86.72,46.08) v1(86.72,41) v1(86.72,25.76) v1(86.72,20.68) v1(86.72,15.6) v1(86.72,10.52) v1(86.72,5.44) v1(89.38,9.32) v1(89.38,8.31) v1(90.42,9.32) v1(90.42,8.31) v1(91.47,9.32) v1(91.47,8.31) v1(91.8,96.88) v1(91.8,91.8) v1(91.8,86.72) v1(91.8,81.64) v1(91.8,76.56) v1(91.8,71.48) v1(91.8,66.4) v1(91.8,61.32) v1(91.8,56.24) v1(91.8,25.76) v1(91.8,20.68) v1(91.8,15.6) v1(91.8,10.52) v1(91.8,5.44) v1(96.88,96.88) v1(96.88,91.8) v1(96.88,86.72) v1(96.88,81.64) v1(96.88,76.56) v1(96.88,71.48) v1(96.88,66.4) v1(96.88,61.32) v1(96.88,56.24) v1(96.88,41) v1(96.88,35.92) v1(96.88,30.84) v1(96.88,25.76) v1(96.88,20.68) v1(96.88,15.6) v1(96.88,10.52)
VBAT: length 16.9
  Bottom Layer w0.254: U1.21 H2.20
ADC0: length 32.7
  Top Layer w0.254: H2.14 8.37,53.89 7.37,52.88 7.37,47.68 6.72,47.03 CN1.5
  Bottom Layer w0.254: U1.27 H2.14
ADC1: length 32
  Top Layer w0.254: CN1.4 7.13,45.03 8.25,46.15 8.25,50.47 9.14,51.35 H2.13
  Bottom Layer w0.254: H2.13 U1.28
ADC2: length 31.3
  Top Layer w0.254: H2.12 10.15,48.81 9.14,47.8 9.14,44.25 7.92,43.03 CN1.3
  Bottom Layer w0.254: H2.12 U1.29
ADC3: length 31
  Top Layer w0.254: H2.11 10.66,46.27 9.91,45.52 9.91,42.09 8.84,41.03 CN1.2
  Bottom Layer w0.254: H2.11 U1.30
ADC4: length 27
  Top Layer w0.254: H2.8 12.99,38.66 10.41,38.66 10.05,39.03 CN1.1
  Bottom Layer w0.254: H2.8 U1.33
AIN1: length 81.4
  Top Layer w0.254: H1.1 67.05,20.87 v1(67.18,21.01)
  Bottom Layer w0.254: U1.1 H1.1 ; H14.3 73.92,63.81 73.03,62.92 73.03,22.4 71.63,21.01 v1(67.18,21.01)
AIN2: length 81.5
  Top Layer w0.254: v1(67.44,23.42) 62.01,23.42 H1.2
  Bottom Layer w0.254: U1.2 H1.2 ; H14.2 73.03,66.35 72.01,65.33 72.01,24.56 70.87,23.42 v1(67.44,23.42)
AO1: length 56.1
  Top Layer w0.254: U9.1 88.57,97.92 88.14,98.35 77.85,98.35 77.22,97.71 77.22,62.41 76.07,61.27 70,61.27 H15.4
AO2: length 45.6
  Top Layer w0.254: H15.5 70.13,58.6 76.84,58.6 78.57,60.33 U9.6
BIN1: length 71.3
  Top Layer w0.254: H1.3 62.01,25.96 v1(74.17,25.96)
  Bottom Layer w0.254: U1.3 H1.3 ; H14.5 78.62,58.73 77.09,57.2 74.93,57.2 74.17,56.44 v1(74.17,25.96)
BIN2: length 67
  Top Layer w0.254: v1(75.06,28.63) 62.14,28.63 H1.4
  Bottom Layer w0.254: H14.6 75.95,56.19 75.06,55.3 v1(75.06,28.63) ; U1.4 H1.4
BO1: length 54.7
  Bottom Layer w0.254: U10.1 65.15,3.27 65.15,5.38 65.53,5.77 65.53,53.01 66.17,53.65 H15.7
BO2: length 65.7
  Bottom Layer w0.254: U10.6 55.25,3.27 55.25,5.89 55.88,6.53 63.12,6.53 64.52,7.93 64.52,54.66 66.04,56.19 H15.6
E1A: length 121.5
  Top Layer w0.254: U1.31 29.89,43.74 36.32,43.74 37.21,44.63 37.21,71.04 38.1,71.93 v1(59.69,71.93)
  Bottom Layer w0.254: U9.3 84.57,92.62 83.82,91.87 76.2,91.87 74.93,90.6 74.93,73.08 73.79,71.93 v1(59.69,71.93) ; H2.10 U1.31
E1B: length 122
  Top Layer w0.254: v1(60.96,72.69) 60.96,71.3 60.71,71.04 38.86,71.04 38.23,70.41 38.23,41.96 37.47,41.2 29.89,41.2 U1.32
  Bottom Layer w0.254: v1(60.96,72.69) 60.96,72.69 60.99,72.72 61.45,72.72 61.47,72.69 73.15,72.69 74.17,73.71 74.17,90.73 75.95,92.51 81.91,92.51 82.57,93.16 U9.4 ; H2.9 U1.32
E2A: length 74.8
  Top Layer w0.254: U10.3 61.2,16.2 59.94,17.45 53.47,17.45 52.96,17.96 v1(52.96,53.9)
  Bottom Layer w0.254: U1.14 H1.14
E2B: length 76.4
  Top Layer w0.254: v1(51.89,56.44) 51.89,17.63 52.71,16.81 58.29,16.81 59.2,15.91 U10.4
  Bottom Layer w0.254: U1.15 H1.15
ECHO: length 80.3
  Top Layer w0.254: 96.27,51.87 93.6,51.87 92.46,50.72 92.46,33.96 90.71,32.21 60.04,32.21 59.31,32.94 59.31,38.28 59.69,38.66 61.99,38.66 H1.8
  Bottom Layer w0.254: U1.8 H1.8
INPUT: length 14.5
  Top Layer w0.762: SW24.2 23.7,97.59 11.56,97.59 11.05,97.08 CN2.2
MSCL: length 91
  Top Layer w0.254: H18.3 76.07,15.16 74.8,16.43 v1(62.87,16.43) ; v1(38.77,33.58) 29.89,33.58 U1.35
  Bottom Layer w0.254: v1(38.77,33.58) 38.77,18.94 39.88,17.83 61.47,17.83 v1(62.87,16.43) ; H2.6 U1.35
MSDA: length 91.3
  Top Layer w0.254: U1.36 30.02,31.17 v1(39.88,31.17) ; v1(54.36,18.59) 61.85,18.59 62.99,17.45 76.96,17.45 78.61,15.8 H18.4
  Bottom Layer w0.254: v1(54.36,18.59) 40.51,18.59 39.88,19.23 v1(39.88,31.17) ; H2.5 U1.36
OSCL: length 48.3
  Top Layer w0.254: H1.16 65.54,58.97 66.55,57.96 66.55,48.95 68.33,47.17 81.28,47.17 81.66,46.79 OLED1.3
  Bottom Layer w0.254: U1.16 H1.16
OSDA: length 53.4
  Top Layer w0.254: OLED1.4 84.2,46.91 83.31,47.8 68.71,47.8 67.44,49.07 67.44,60.63 66.55,61.52 62.01,61.52 H1.17
  Bottom Layer w0.254: U1.17 H1.17
PA0: length 86.7
  Top Layer w0.254: v1(39.62,70.21) 44.67,70.21 44.67,70.21 45.57,70.21 45.57,70.21 59.31,70.21 v1(59.44,70.33)
  Bottom Layer w0.254: v1(39.62,70.21) 39.62,59.36 39.24,58.98 29.89,58.98 U1.25 H2.16 ; v1(59.44,70.33) 59.77,70.66 64.39,70.66 64.64,70.41 64.64,67.87 65.15,67.36 69.56,67.36 69.57,67.38 70.43,67.38 70.44,67.36 81.79,67.36 83.32,68.89 H14.1
PA1: length 89.9
  Top Layer w0.254: v1(77.6,53.65) 76.96,53.01 76.96,48.95 76.71,48.69 v1(69.22,48.69) ; v1(66.42,45.01) v1(54.23,45.01)
  Bottom Layer w0.254: v1(66.42,45.01) 68.45,45.01 69.22,45.77 v1(69.22,48.69) ; v1(77.6,53.65) H14.7 ; v1(54.23,45.01) 34.04,45.01 32.89,46.15 32.89,55.55 32.13,56.31 30,56.31 U1.26 H2.15
PA8: length 68.4
  Top Layer w0.254: U2.2 96.14,49.45 94.23,49.45 93.47,48.69 93.47,32.31 92.2,31.04 62.01,31.04 H1.5
  Bottom Layer w0.254: U1.5 H1.5
PA9: length 101.9
  Top Layer w0.254: H1.6 62.01,33.58 89.41,33.58 90.93,35.1 90.93,84.12 88.96,86.09 H19.2
  Bottom Layer w0.254: U1.6 H1.6
PA10: length 95.6
  Top Layer w0.254: H1.7 62.01,36.12 88.9,36.12 89.79,37.01 89.79,82.73 88.96,83.56 85.28,83.56
  Bottom Layer w0.254: U1.7 H1.7
PA12: length 16.9
  Bottom Layer w0.254: U1.9 H1.9
PA15: length 16.9
  Bottom Layer w0.254: U1.10 H1.10
PB1: length 70.2
  Top Layer w0.254: 43.96,2.75 44,2.8 C14.1 44,15.74 43.56,16.18 v1(37.47,16.18) ; 43.96,2.75 42.4,2.75 ; 43.96,2.75 48.9,2.75
  Bottom Layer w0.254: v1(37.47,16.18) 37.47,35.48 36.84,36.11 U1.34 H2.7
PB3: length 100.9
  Top Layer w0.254: v1(14.86,16.94) 14,16.08 C11.1 14,2.8 14.04,2.75 ; 14.04,2.75 SW20.B' ; 14.04,2.75 SW20.B ; v1(25.27,16.94) 48.39,16.94 48.93,17.49 v1(48.93,46.18)
  Bottom Layer w0.254: U1.11 H1.11 ; v1(14.86,16.94) v1(25.27,16.94)
PB4: length 16.9
  Bottom Layer w0.254: U1.12 H1.12
PB5: length 16.9
  Bottom Layer w0.254: U1.13 H1.13
PC13: length 16.9
  Bottom Layer w0.254: U1.22 H2.19
PC14: length 87
  Top Layer w0.254: 22.43,2.75 23.96,2.75 ; 23.96,2.75 28.93,2.75 ; 23.96,2.75 24,2.79 C12.1 24,12.5 23.5,13 22.99,13 22.81,13.18 22.81,17.38 22.48,17.7 21.21,17.7 20.9,18.01 v1(20.9,64.06)
  Bottom Layer w0.254: U1.23 H2.18
PC15: length 91.7
  Top Layer w0.254: 33.91,2.84 34,2.94 C13.1 34,12.53 33.27,13.26 24.51,13.26 23.62,14.15 23.62,17.7 22.99,18.34 v1(22.99,61.52) ; 32.48,2.75 38.98,2.75
  Bottom Layer w0.254: 13.16,61.67 13.32,61.51 U1.24
RESET: length 16.9
  Bottom Layer w0.254: H2.4 U1.37
$1N9451: length 2.8
  Top Layer w0.254: LED1.1 54.1,78.68 R5.2
$2N419: length 2.2
  Top Layer w0.762: LED2.1 73.78,96.91 R7.1

## Copper pours and planes (outline as drawn; the poured copper is in the pictures)
+3.3V on Top Layer: 7.46,83.49 52.58,83.49 52.58,73.75 7.46,73.75
+5V on Top Layer: 7.37,89.08 37.34,89.08 37.34,78.54 7.37,78.54
GND on Top Layer: -9.14,103.94 125.73,103.94 125.73,-10.62 -9.14,-10.62
GND on Bottom Layer: -7.37,105.08 118.62,105.08 118.62,-10.62 -7.37,-10.62

Small or netless copper shapes (teardrops, artwork), in the pictures only: 123 on Top Layer, 115 on Bottom Layer

## Text on the board
Top Silkscreen Layer: RESET | VBAT | ECHO | PC14 | PC13 | PC15 | PB10 | PA4 | PA7 | PA5 | PA3 | PA2 | PA0 | 3V3 | GND | PA6 | PB0 | PA1 | PB1 | PA15 | PA12 | PA10 | PB14 | PB15 | PB13 | PB12 | PA11 | PA8 | PB4 | PA9 | PB8 | PB7 | PB5 | PB3 | PB9 | PB6 | 5V | VCC | +3.3V | +5V | +3V3输出 | 电机驱动 | 姿态传感器 | 循迹模块输入 | 蓝牙模块 | 超声波模块 | 驱动模块
